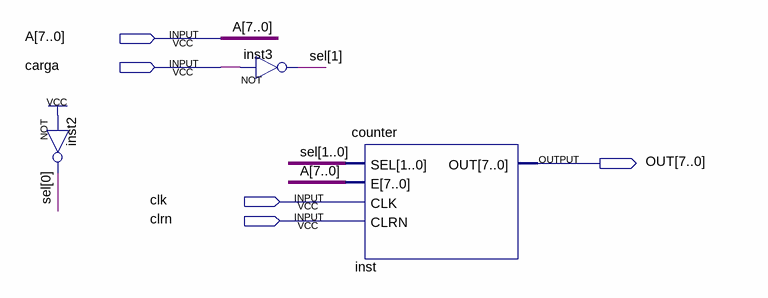
[diagram p0: schematic sheet]
// Quartus schematic registrador.bdf as structural Verilog: 3 symbols, 5 pins
module registrador (
  input  [7:0] A,
  input  carga,
  input  clk,
  input  clrn,
  output [7:0] OUT
);

  wire [1:0] sel;

  not inst2 (sel[0], 1'b1);
  not inst3 (sel[1], carga);
  counter inst (.SEL(sel), .E(A), .CLK(clk), .CLRN(clrn), .OUT(OUT));
endmodule
